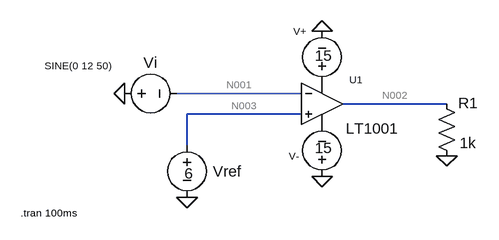
[diagram p0: schematic 02.Comperator.asc]
02.Comperator.asc, the LTspice schematic file:
Version 4
SHEET 1 880 680
WIRE 176 160 -16 160
WIRE 400 176 240 176
WIRE 176 192 0 192
WIRE 0 240 0 192
FLAG -96 160 0
FLAG 0 320 0
FLAG 208 288 0
FLAG 208 64 0
FLAG 400 256 0
SYMBOL OpAmps\\LT1001 208 112 R0
WINDOW 0 42 27 Left 1
WINDOW 3 37 102 Left 2
SYMATTR InstName U1
SYMBOL voltage -112 160 R270
WINDOW 0 32 56 VTop 2
WINDOW 3 53 -56 VBottom 1
WINDOW 123 0 0 Left 0
WINDOW 39 0 0 Left 0
SYMATTR InstName Vi
SYMATTR Value SINE(0 12 50)
SYMBOL voltage 208 160 R180
WINDOW 0 24 96 Left 1
WINDOW 3 -16 58 Left 2
WINDOW 123 0 0 Left 0
WINDOW 39 0 0 Left 0
SYMATTR InstName V+
SYMATTR Value 15
SYMBOL voltage 208 304 R180
WINDOW 0 35 48 Left 1
WINDOW 3 -16 60 Left 2
WINDOW 123 0 0 Left 0
WINDOW 39 0 0 Left 0
SYMATTR InstName V-
SYMATTR Value 15
SYMBOL voltage 0 224 R0
WINDOW 0 40 56 Left 2
WINDOW 3 -4 59 Left 2
WINDOW 123 0 0 Left 0
WINDOW 39 0 0 Left 0
SYMATTR InstName Vref
SYMATTR Value 6
SYMBOL res 384 160 R0
WINDOW 0 34 15 Left 2
SYMATTR InstName R1
SYMATTR Value 1k
TEXT -256 344 Left 1 !.tran 100ms

The netlist it stands for:
* 02.Comperator.asc
XU1 N003 N001 P001 P002 N002 LT1001  ; pins In+ In- V+ V- OUT
Vi 0 N001 SINE(0 12 50)
V+ P001 0 15
V- 0 P002 15
Vref N003 0 6
R1 N002 0 1k
.tran 100ms
.lib LTC.lib
.backanno
.end

* Results of the author's LTspice run, read from the files saved beside the schematic
* Operating Point, zero values left out:
*   V(n003) = 6 V
*   V(p001) = 15 V
*   V(p002) = -15 V
*   V(n002) = 13.58 V
*   I(R1) = 13.58 mA
*   I(Vref) = -3.913 mA
*   I(V-) = -3.042 nA
*   I(V+) = -13.58 mA
*   I(Vi) = -3.913 mA
*   Ix(u1:1) = 3.913 mA
*   Ix(u1:2) = -3.913 mA
*   Ix(u1:3) = 13.58 mA
*   Ix(u1:4) = -3.013 nA
*   Ix(u1:5) = -13.58 mA
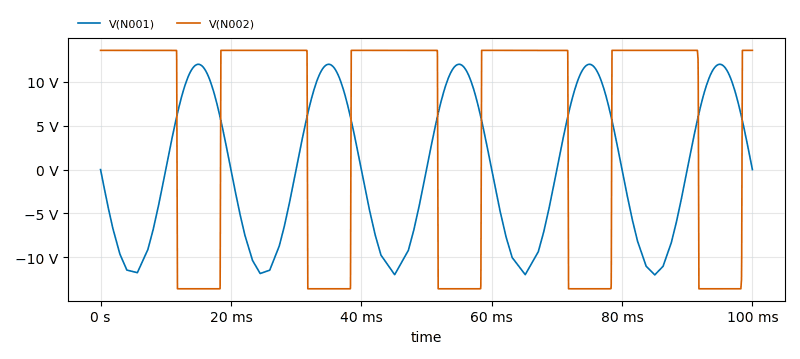
[diagram p1: Transient Analysis of 02.Comperator.asc, plotted from the saved traces]
* Transient Analysis, 1 run:
*   V(N001): min -12 V, max 12 V, average 63.55 mV, rms 8.43 V, last 0 V
*   V(N002): min -13.59 V, max 13.58 V, average 4.529 V, rms 13.53 V, last 13.58 V